# Altium schematic sheet 01-M2_ZED-F9T_MODULE.SchDoc: NOT USED
size A; ApprovedBy: NOT USED; CheckedBy: NOT USED; Author: NOT USED; CompanyName: NOT USED; DrawnBy: NOT USED; Engineer: NOT USED; Organization: NOT USED; Address1: NOT USED; Address2: NOT USED; Address3: NOT USED; Address4: NOT USED; Revision: NOT USED; SheetNumber: 1; SheetTotal: 3; sch_PageDescription: sch_PageDescription; sch_PageTitle: sch_PageTitle; SPICEModelCacheWBLFPAIA: <root> / <DocumentId>WBLFPAIA</DocumentId> / </root>; DocumentFullPathAndName: NOT USED; DocumentName: NOT USED; ImagePath: NOT USED; ProjectName: NOT USED; Application_BuildNumber: NOT USED
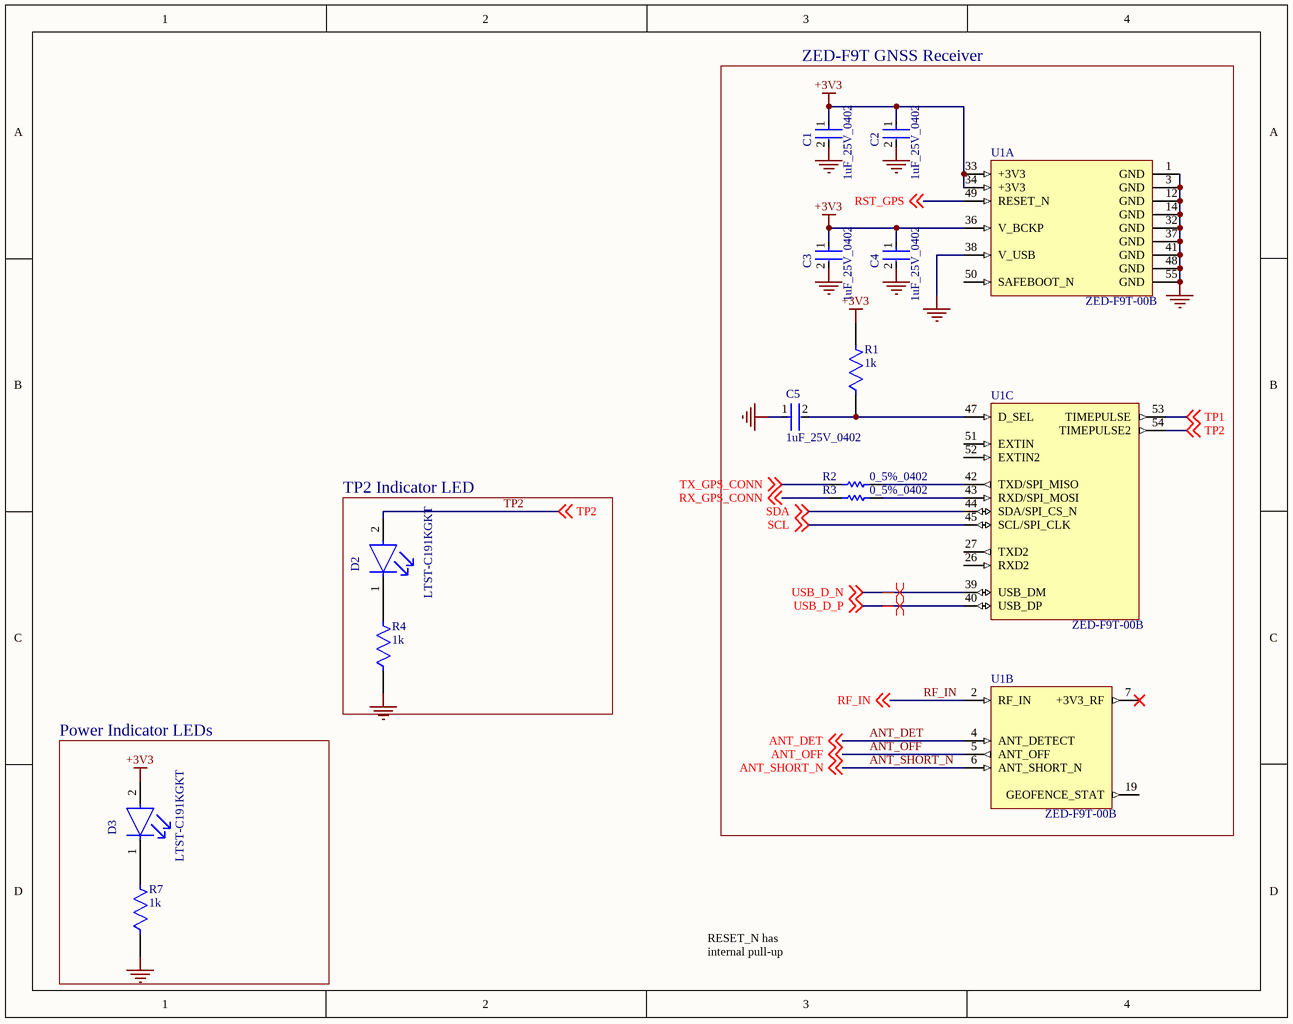
[diagram p0: 01-M2_ZED-F9T_MODULE.SchDoc]

## Parts
C1  1uF_25V_0402  [FP-CL542-IPC_C]
C2  1uF_25V_0402  [FP-CL542-IPC_C]
C3  1uF_25V_0402  [FP-CL542-IPC_C]
C4  1uF_25V_0402  [FP-CL542-IPC_C]
C5  1uF_25V_0402  [FP-CL542-IPC_C]
D2  LTST-C191KGKT  [FP-LTST-C191KGKT-MFG]
D3  LTST-C191KGKT  [FP-LTST-C191KGKT-MFG]
R1  1k  [FP-RMCF0402-MFG]
R2  0_5%_0402  [RESC1005X40X25NL05T10]
R3  0_5%_0402  [RESC1005X40X25NL05T10]
R4  1k  [FP-RMCF0402-MFG]
R7  1k  [FP-RMCF0402-MFG]
U1  ZED-F9T-00B  [GPS_ZED-F9T]  (parts A,B,C of 3)

## Blocks framed on the sheet
ZED-F9T GNSS Receiver: C1-C5 R1-R3 U1
TP2 Indicator LED: D2 R4
Power Indicator LEDs: D3 R7

## Nets
+3V3: C1.1 C2.1 C3.1 C4.1 D3.2(A) R1.2 U1.33(+3V3) U1.34(+3V3) U1.36(V_BCKP)
GND: C1.2 C2.2 C3.2 C4.2 C5.1 R4.1 R7.1 U1.1(GND) U1.3(GND) U1.12(GND) U1.14(GND) U1.32(GND) U1.37(GND) U1.38(V_USB) U1.41(GND) U1.48(GND) U1.55(GND)
ANT_DET: U1.4(ANT_DETECT) ; off-sheet ANT_DET
ANT_OFF: U1.5(ANT_OFF) ; off-sheet ANT_OFF
ANT_SHORT_N: U1.6(ANT_SHORT_N) ; off-sheet ANT_SHORT_N
RF_IN: U1.2(RF_IN) ; off-sheet RF_IN
RST_GPS: U1.49(RESET_N) ; off-sheet RST_GPS
RX_GPS_CONN: R3.1 ; off-sheet RX_GPS_CONN
SCL: U1.45(SCL/SPI_CLK) ; off-sheet SCL
SDA: U1.44(SDA/SPI_CS_N) ; off-sheet SDA
TP1: U1.53(TIMEPULSE) ; off-sheet TP1
TP2: D2.2(A) U1.54(TIMEPULSE2) ; off-sheet TP2
TX_GPS_CONN: R2.1 ; off-sheet TX_GPS_CONN
USB_D_N: U1.39(USB_DM) ; off-sheet USB_D_N
USB_D_P: U1.40(USB_DP) ; off-sheet USB_D_P
NetC5_2: C5.2 R1.1 U1.47(D_SEL)
NetD2_1: D2.1(C) R4.2
NetD3_1: D3.1(C) R7.2
NetR2_2: R2.2 U1.42(TXD/SPI_MISO)
NetR3_2: R3.2 U1.43(RXD/SPI_MOSI)

Not connected (* = marked no-connect by the designer): U1 7(+3V3_RF)* 19(GEOFENCE_STAT) 26(RXD2) 27(TXD2) 50(SAFEBOOT_N) 51(EXTIN) 52(EXTIN2)

## Layout directives
differential pair: USB_D_N, USB_D_P

## Notes on the sheet
- RESET_N has internal pull-up
- CONFIDENTIALITY NOTICE
- TITLE
- PROJECT
- ENGINEER
- FILENAME
- GENERATED DATE
- DESCRIPTION
- SCHEMATIC NUMBER
- REV
- SHEET
- THIS DOCUMENT IS CONFIDENTIAL AND CONTAINS DESIGNS AND OTHER PROPRIETARY INFORMATION OF META PLATFORMS TECHNOLOGIES, LLC AND ITS AFFILIATES. THIS DOCUMENT AND THE INFORMATION IT CONTAINS MAY NOT BE DUPLICATED, DISCLOSED OR USED, IN WHOLE OR IN PART, FOR ANY PURPOSE (INCLUDING MANUFACTURE OF ANY COMPONENT) WITHOUT THE PRIOR WRITTEN CONSENT OF META PLATFORMS TECHNOLOGIES, LLC.

## Library data of the parts
C1-C5 = CMP-13271-001051-1: Cap Ceramic 1uF 25V X5R ±10% SMD 0402 +85°C Paper T/R; Radiation Hardening: No; Lead Free: Lead Free; Capacitance: 1uF; Package Quantity: 10000; Max Operating Temperature: 85°C; Voltage Rating: 25V; Case/Package: 0402; Min Operating Temperature: -55°C; Packaging: Tape and Reel; Tolerance: 10%; Height: 0.5mm; Thickness: 0.022inch; Case Code (Metric): 1005; Width: 0.02inch; Case Code (Imperial): 0402; Dielectric: X5R; Length: 1mm; Mount: Surface Mount; Material: Ceramic; Depth: 0.5mm
D2 D3 = CMP-2000-05198-2: LED GREEN CLEAR SMD; Max Power Dissipation: 75mW; Forward Current: 30mA; Reverse Voltage: 5V; Lens Color: Colorless; Forward Voltage: 2V; Dominant Wavelength: 571nm; Number of LEDs: 1; Viewing Angle: 130°; Lens Style: Rectangular; Test Current: 20mA; Luminous Intensity: 35mcd; Wavelength: 574nm; Width: 0.8mm; Case Code (Imperial): 0603; Number of Pins: 2; Lead Free: Lead Free; Packaging: Tape and Reel; Package Quantity: 1; Min Operating Temperature: -55°C; Case/Package: 0603; Length: 1.6mm; Power Dissipation: 75mW; Depth: 0.8mm; Radiation Hardening: No; Mount: Surface Mount; Max Operating Temperature: 85°C; Color: Green; Power Rating: 75mW; Height: 0.55mm; Illumination Color: Green; Case Code (Metric): 1608; Lens Transparency: Clear; Number of Elements: 1
R1 R4 R7 = CMP-26527-000026-1: 1kΩ ±1% 0.063W 0402 Thick Film Chip Resistor AEC-Q200 compliant; Resistance: 1kR; Temperature Coefficient: 100ppm/°C; Power Rating: 63mW; Length: 1mm; RoHS Compliant: Yes; Construction: Rectangular; Height: 0.016inch; Size Code: 0402; Lead Free: Lead Free; Radiation Hardening: No; Tolerance: 1%; Width: 0.02inch; Military Standard: Not; Resistor Type: Thick Film; Number of Terminations: 2; Min Operating Temperature: -55°C; Max Operating Temperature: 155°C; Depth: 0.5mm; Features: Automotive AEC-Q200; Packaging: Tape and Reel; Case Code (Metric): 1005; Mount: Surface Mount; Contact Plating: Tin; Max Power Dissipation: 63mW; Case/Package: 0402; Case Code (Imperial): 0402; Series: RMCF
R2 R3 = CMP-2002-06457-1: Manufacturer: Panasonic; Part Number: ERJ-U020R00X
U1 = GPS_ZED-F9T: Multi-band GNSS Receiver with Nanosecond-level Timing Accuracy; Manufacturer: u-blox; Interface: I2C,SPI,USB,UART; Sensitivity: -166dBm; Supplier 1: Digi-Key; Manufacturer Part Number: ZED-F9T-00B; RoHS: Yes; Category: RF Receivers, Transceivers; Stock 1: 826; Pricing 1: 1=199.00000, 10=198.80000, 50=180.89020 (USD); Case/Package: SMD/SMT; Min Operating Temperature: -40°C; Max Operating Temperature: 85°C; Packaging: Tape and Reel; ComponentLink1URL: https://www.u-blox.com/sites/default/files/ZED-F9T_ProductSummary_%28UBX-18011626%29.pdf?src-supplier=Digi-Key; ComponentLink1Description: https://www.u-blox.com/sites/default/files/ZED-F9T_ProductSummary_%28UBX-18011626%29.pdf?src-supplier=Digi-Key; Supplier Part Number 1: 672-1197-1-ND